# EAGLE design Echo locator (EAGLE 7.6.0)
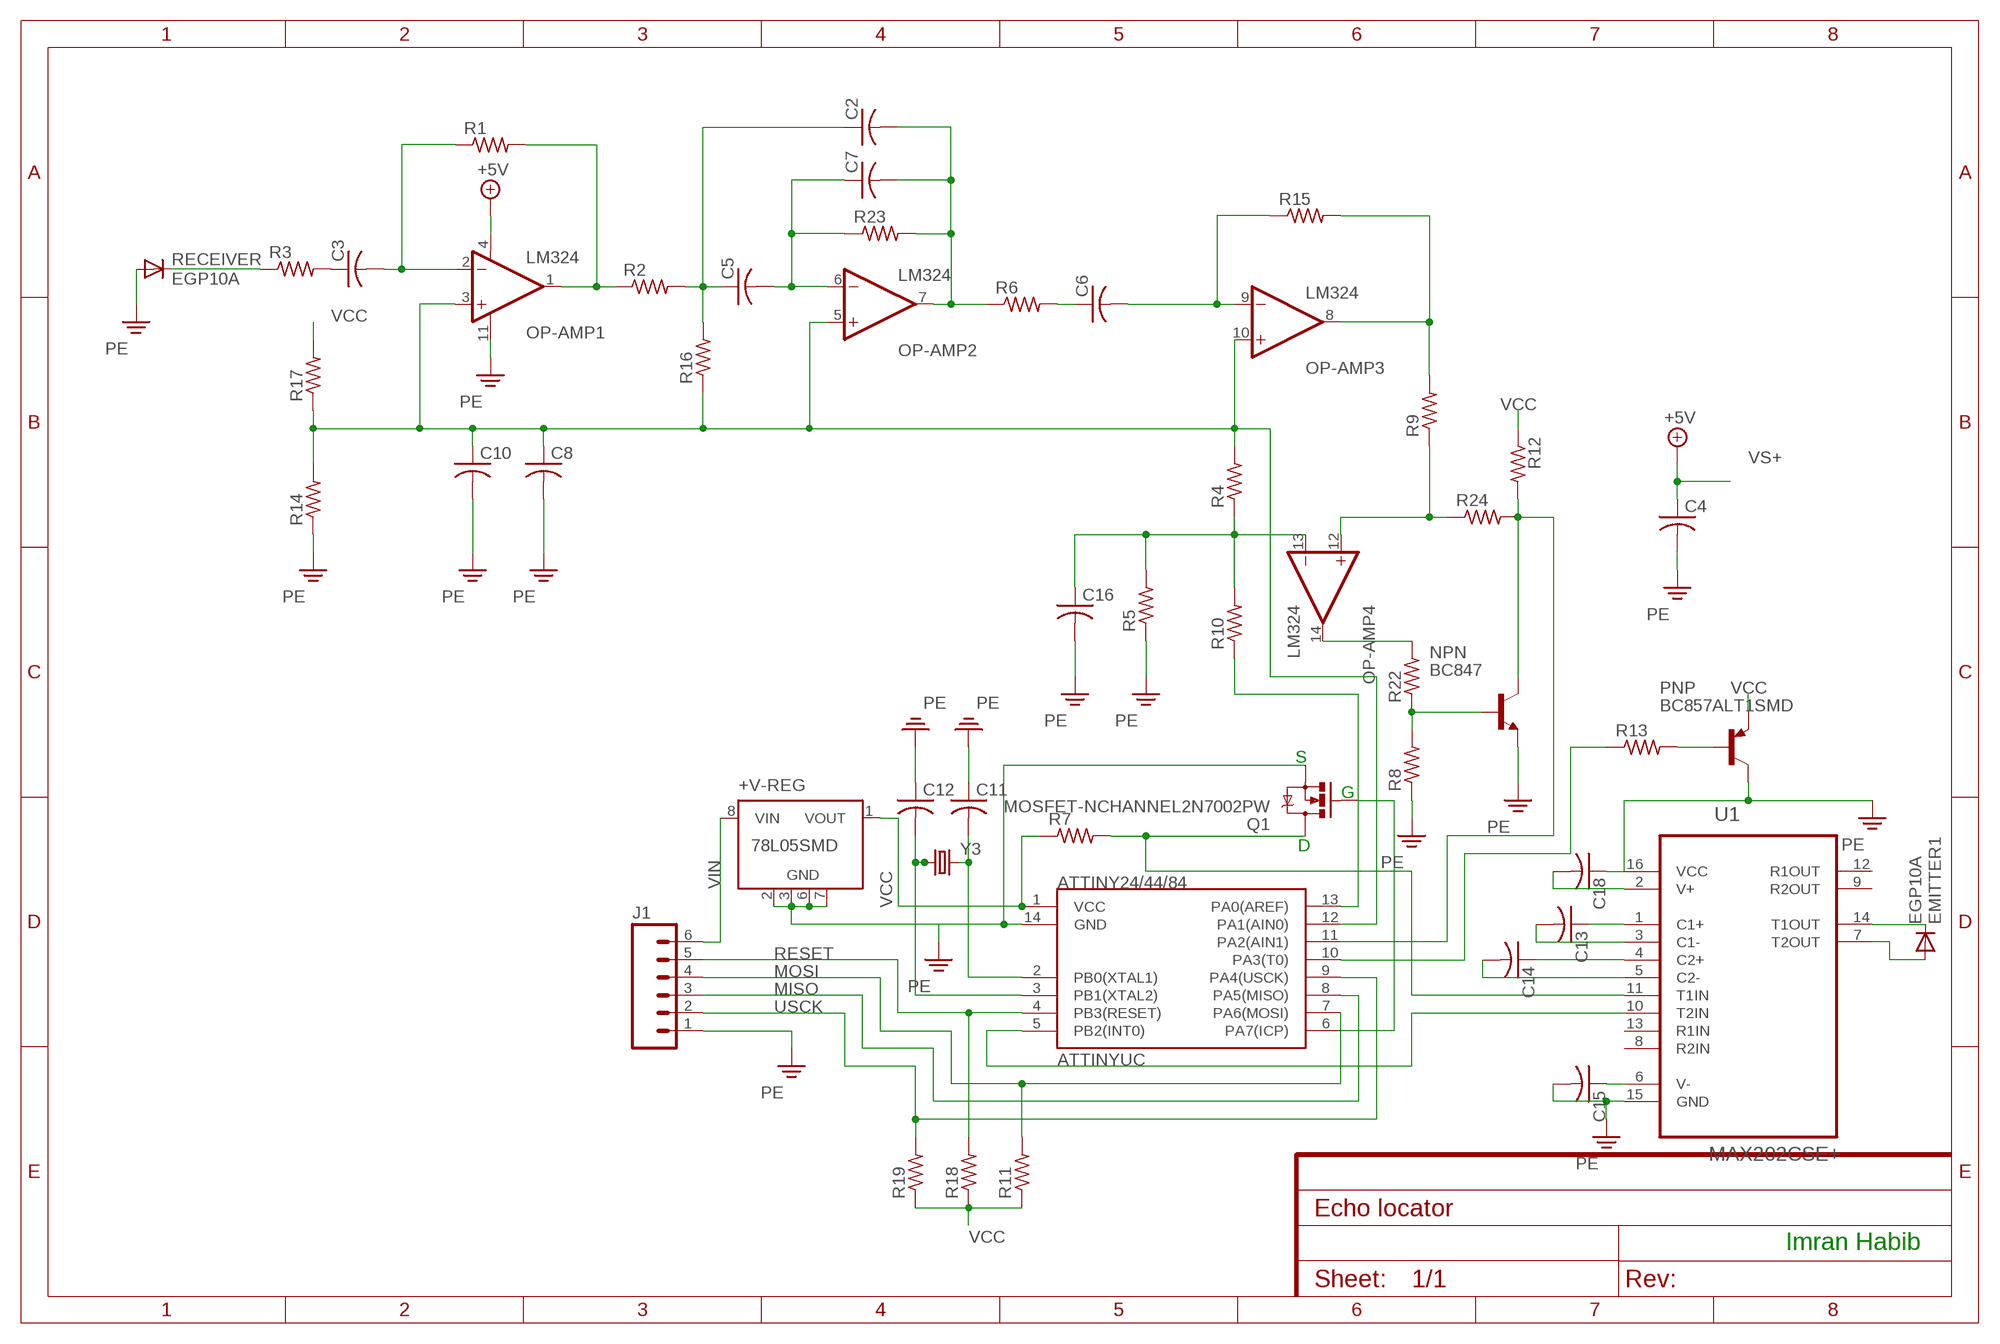
[diagram p0: schematic, sheet 1]

## Parts
+V-REG  78L05SMD  [SO08]
ATTINYUC  ATTINY24  [SOIC-14]
C2  C-USC0805  [C0805]
C3  C-USC0805  [C0805]
C4  C-USC0805  [C0805]
C5  C-USC0805  [C0805]
C6  C-USC0805  [C0805]
C7  C-USC0805  [C0805]
C8  C-USC0805  [C0805]
C10  C-USC0805  [C0805]
C11  C-USC0805  [C0805]
C12  C-USC0805  [C0805]
C13  C-USC0805  [C0805]
C14  C-USC0805  [C0805]
C15  C-USC0805  [C0805]
C16  C-USC0805  [C0805]
C18  C-USC0805  [C0805]
EMITTER1  EGP10A  [DO41-10]
J1  M06LONGPADS  [1X06_LONGPADS]
NPN  BC847  [SOT23]
OP-AMP  LM324  [SOIC-14]
PNP  BC857ALT1SMD  [SOT23-BEC]
Q1  MOSFET-NCHANNEL2N7002PW  [SOT323]
R1  R-US_M2012  [M2012]
R2  R-US_M2012  [M2012]
R3  R-US_M2012  [M2012]
R4  R-US_M2012  [M2012]
R5  R-US_M2012  [M2012]
R6  R-US_M2012  [M2012]
R7  R-US_M0805  [M0805]
R8  R-US_M2012  [M2012]
R9  R-US_M2012  [M2012]
R10  R-US_M2012  [M2012]
R11  R-US_M2012  [M2012]
R12  R-US_M2012  [M2012]
R13  R-US_M2012  [M2012]
R14  R-US_M2012  [M2012]
R15  R-US_M2012  [M2012]
R16  R-US_M2012  [M2012]
R17  R-US_M2012  [M2012]
R18  R-US_M2012  [M2012]
R19  R-US_M2012  [M2012]
R22  R-US_M2012  [M2012]
R23  R-US_M2012  [M2012]
R24  R-US_M2012  [M2012]
RECEIVER  EGP10A  [DO41-10]
U1  MAX202CSE+  [SOIC127P600X175-16N]
Y3  CRYSTALHC49US  [HC49US]

## Nets
+5V: OP-AMP.4(1:V+)
GND: +V-REG.2(GND) +V-REG.3(GND) +V-REG.6(GND) +V-REG.7(GND) ATTINYUC.14(GND) C4.2 C8.2 C10.2 C11.1 C12.1 C16.2 J1.1 NPN.2(E) OP-AMP.11(1:V-) Q1.2(S) R5.1 R8.1 R14.1 RECEIVER.A ; supply symbol labelled PE
MISO: ATTINYUC.8(PA5(MISO)) J1.3
MOSI: ATTINYUC.7(PA6(MOSI)) J1.4 R11.2
N$1: C3.1 R3.2
N$2: C3.2 OP-AMP.2(1:-IN) R1.1
N$3: ATTINYUC.12(PA1(AIN0)) C8.1 C10.1 OP-AMP.3(1:+IN) OP-AMP.5(2:+IN) OP-AMP.10(3:+IN) R4.2 R14.2 R16.1 R17.1
N$4: OP-AMP.1(1:OUT) R1.2 R2.1
N$5: C2.1 C5.1 R2.2 R16.2
N$6: C5.2 C7.1 OP-AMP.6(2:-IN) R23.1
N$7: C6.1 R6.2
N$8: C2.2 C7.2 OP-AMP.7(2:OUT) R6.1 R23.2
N$9: C6.2 OP-AMP.9(3:-IN) R15.1
N$11: OP-AMP.8(3:OUT) R9.2 R15.2
N$12: OP-AMP.14(4:OUT) R22.2
N$13: OP-AMP.12(4:+IN) R9.1 R24.1
N$14: NPN.1(B) R8.2 R22.1
N$15: ATTINYUC.11(PA2(AIN1)) NPN.3(C) R12.2 R24.2
N$16: C16.1 OP-AMP.13(4:-IN) R4.1 R5.2 R10.2
N$18: PNP.B R13.2
N$21: R3.1 RECEIVER.C
N$24: ATTINYUC.10(PA3(T0)) R13.1
N$25: ATTINYUC.13(PA0(AREF)) R10.1
N$27: ATTINYUC.2(PB0(XTAL1)) C11.2 Y3.2
N$28: ATTINYUC.5(PB2(INT0)) U1.10(T2IN)
N$29: ATTINYUC.6(PA7(ICP)) Q1.1(G)
N$31: ATTINYUC.3(PB1(XTAL2)) C12.2 Y3.1
N$40: Q1.3(D) R7.2 U1.11(T1IN)
N$41: C13.1 U1.1(C1+)
N$42: C13.2 U1.3(C1-)
N$43: C14.1 U1.4(C2+)
N$44: C14.2 U1.5(C2-)
N$46: C18.2 U1.2(V+)
N$47: C15.1 U1.6(V-)
N$49: EMITTER1.C U1.14(T1OUT)
N$50: EMITTER1.A U1.7(T2OUT)
PE: C15.2 C18.1 PNP.C U1.15(GND) U1.16(VCC)
RESET: ATTINYUC.4(PB3(RESET)) J1.5 R18.2
USCK: ATTINYUC.9(PA4(USCK)) J1.2 R19.2
VCC: +V-REG.1(VOUT) ATTINYUC.1(VCC) PNP.E R7.1 R11.1 R12.1 R17.2 R18.1 R19.1
VIN: +V-REG.8(VIN) J1.6
VS+: C4.1
Unconnected: +V-REG.4(NC) +V-REG.5(NC) U1.8(R2IN) U1.9(R2OUT) U1.12(R1OUT) U1.13(R1IN)

## Notes on the sheet
- S
- G
- D
- Imran Habib

## Library data of the parts
+V-REG = linear:78L*SMD: Positive VOLTAGE REGULATOR
ATTINYUC = seanvoisen:ATTINY24: Atmel ATtiny24/44/84 Microcontroller
C2-C8 C10-C16 C18 = rcl:C-US: CAPACITOR, American symbol
EMITTER1 RECEIVER = diode:EGP10A: DIODE ultra fast-recovery rectifier
J1 = SparkFun-Connectors:M06: Header 6 Standard 6-pin 0.1" header. Use with straight break away headers (SKU : PRT-00116), right angle break away headers (PRT-00553), swiss pins (PRT-00743), machine pins (PRT-00117), and female headers (PRT-00115). Molex polarized connector foot print use with SKU : PRT-08094 with associated crimp pins and housings. NOTES ON THE VARIANTS LOCK and LOCK_LONGPADS... This footprint was designed to help hold the alignment of a through-hole component (i.e. 6-pin header) while soldering it into place. You may notice that each hole has been shifted either up or down by 0.005 of an inch from it's more standard position (which is a perfectly straight line). This slight alteration caused the pins (the squares in the middle) to touch the edges of the holes. Because they are alternating, it causes a "brace" to hold the component in place. 0.005 has proven to be the perfect amount of "off-center" position when using our standard breakaway headers. Although looks a little odd when you look at the bare footprint, once you have a header in there, the alteration is very hard to notice. Also,if you push a header all the way into place, it is covered up entirely on the bottom side. This idea of altering the position of holes to aid alignment will be further integrated into the Sparkfun Library for other footprints. It can help hold any component with 3 or more connection pins.
NPN = transistor:BC847: NPN TRANSISTOR
OP-AMP = seanvoisen:LM324: LM324 Quad Op-amp
PNP = transistor-pnp:BC857*: PNP Transistror
Q1 = SparkFun-DiscreteSemi:MOSFET-NCHANNEL: Common NMOSFET Parts MFG P/N Store ID Prod ID FDD8780 TRANS-09984 SI7820DN TRANS-11055 FDS6630A IC-08089 2N7002PW TRANS-11151 FQP30N06L COM-10213 TRANS-10060 BSS123LT1G TRANS-08345 BSS138 TRANS-00830 BS170 2N7000; PROD_ID: TRANS-11151
R1-R19 R22-R24 = rcl:R-US_: RESISTOR, American symbol
U1 = Maxim_By_element14_Batch_1:MAX202CSE+: Transceivers; MPN: MAX202CSE+; OC_FARNELL: 9725989; OC_NEWARK: 87H1303; PACKAGE: SOIC-16; SUPPLIER: Maxim
Y3 = SparkFun-FreqCtrl:CRYSTAL: Various standard crystals. Proven footprints.

## Board
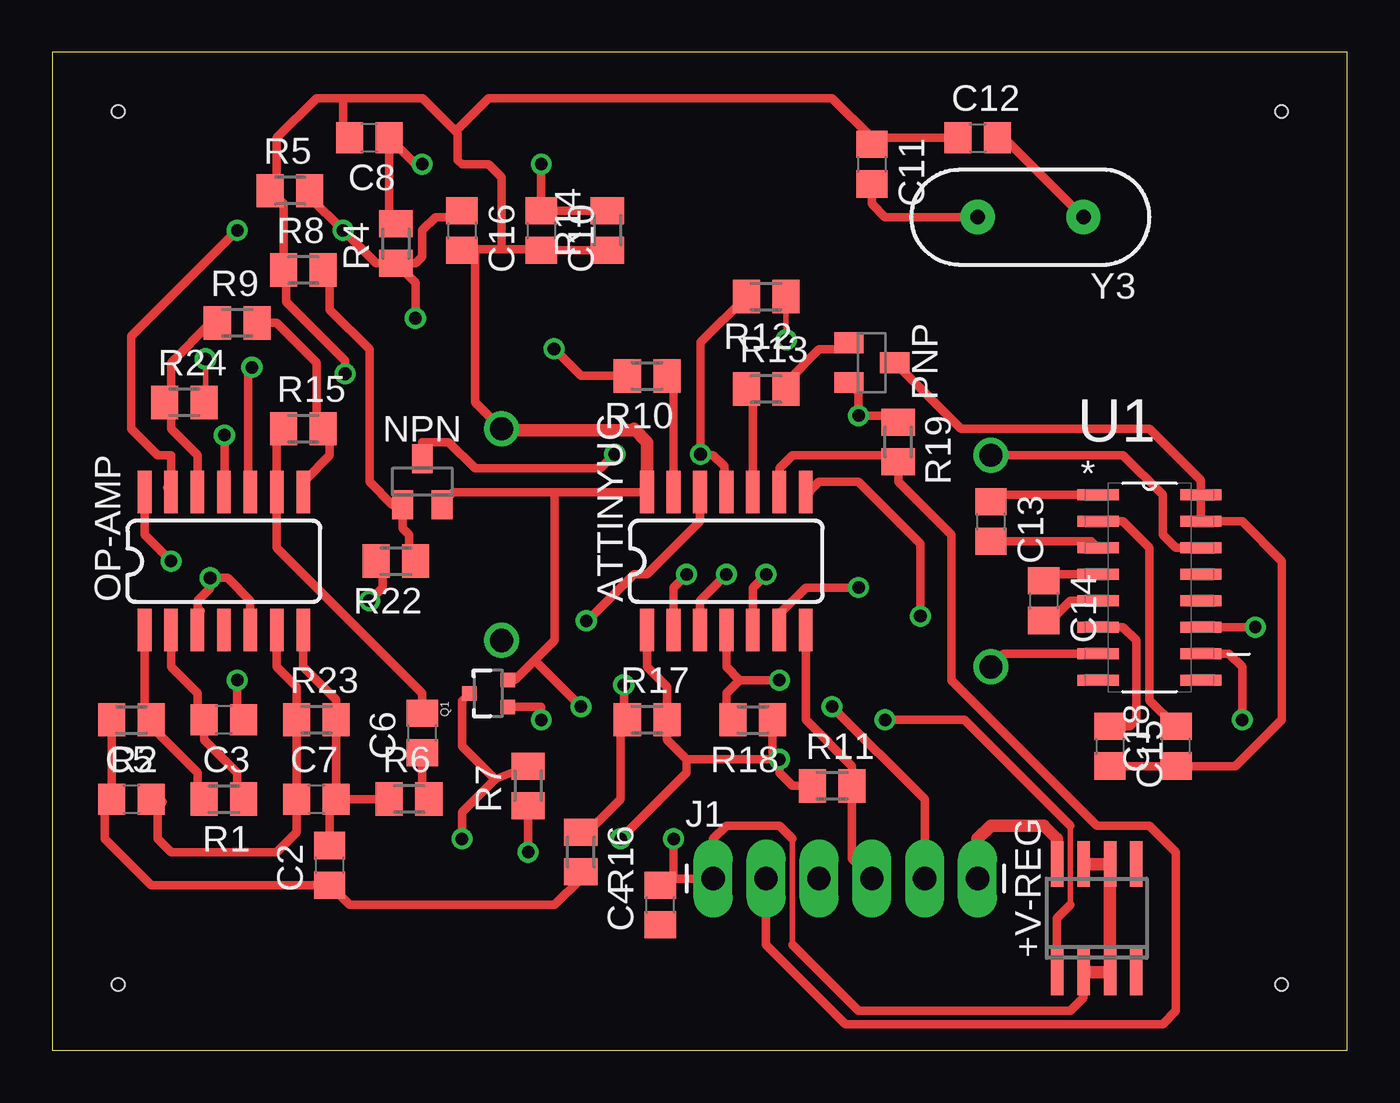
[diagram p1: board, top side]
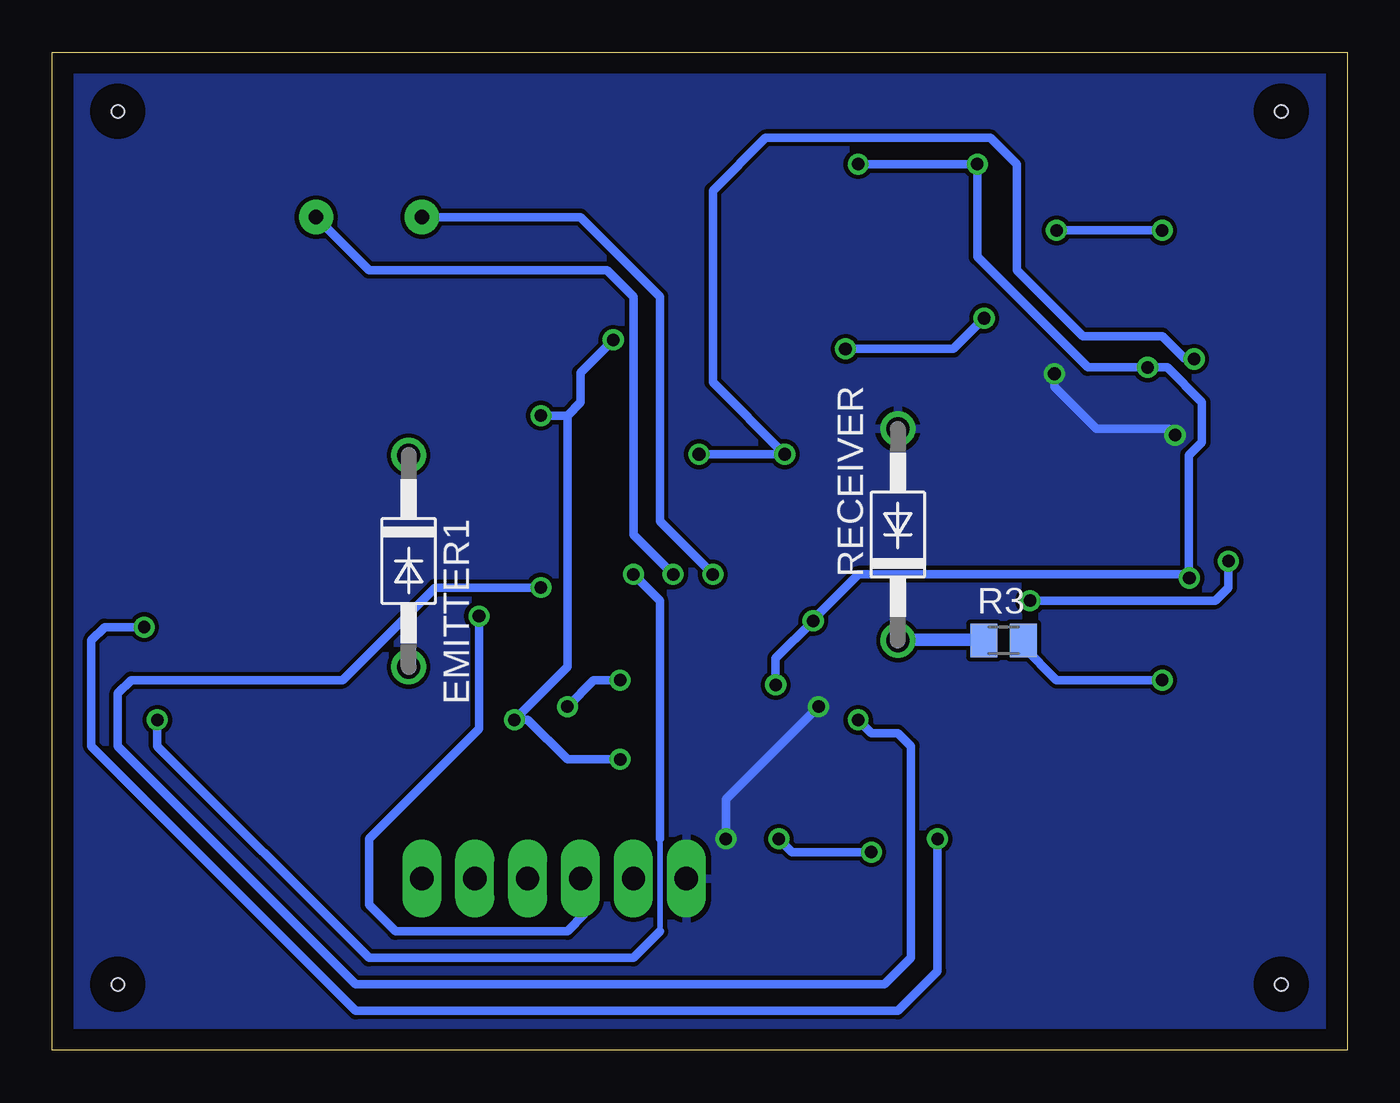
[diagram p2: board, bottom side, seen from below]

Size 62.21 x 47.93 mm. Coordinates in mm from the lower left corner, seen from the top.
Outline: 0,0 62.21,0 62.21,47.93 0,47.93 0,0
Copper layers (1*16): Top 0.035mm / dielectric 1.5mm / Bottom 0.035mm
Design rules "default": minimum track width 10mil, minimum drill 24mil, track to track 8mil, track to pad 8mil, pad to pad 8mil, via to via 8mil, smd to smd 8mil, copper to edge 40mil, drill to drill 8mil, minimum pad ring 10mil, minimum via ring 8mil, stop-mask expansion 4mil, vias tented up to drill 0mil, thermal gap 10mil
Holes 0.6 mm at 59.05,3.17 3.17,3.17 3.17,45.09 59.05,45.09

### Footprints (pad centres in the part's own frame; a part is rotated, then mirrored left to right if it is on the bottom)
SO08 = smd 0.6 x 2.2: 1 -1.905,-2.6; 2 -0.635,-2.6; 3 0.635,-2.6; 4 1.905,-2.6; 5 1.905,2.6; 6 0.635,2.6; 7 -0.635,2.6; 8 -1.905,2.6
SOIC-14 = smd 0.66 x 2.032: 1 -4.445,-3.315; 2 -3.175,-3.315; 3 -1.905,-3.315; 4 -0.635,-3.315; 5 0.635,-3.315; 6 1.905,-3.315; 7 3.175,-3.315; 8 3.175,3.315; 9 1.905,3.315; 10 0.635,3.315; 11 -0.635,3.315; 12 -1.905,3.315; 13 -3.175,3.315; 14 -4.445,3.315
C0805 = smd 1.3 x 1.5: 1 -0.95,0; 2 0.95,0
DO41-10 = drill 1.118: A 5.08,0; C -5.08,0
1X06_LONGPADS = drill 1.118 pad 1.88 long: 1 0,0; 2 2.54,0; 3 5.08,0; 4 7.62,0; 5 10.16,0; 6 12.7,0
SOT23 = smd 1 x 1.4: 1 -0.95,-1.1; 2 0.95,-1.1; 3 0,1.1
SOT23-BEC = smd 1 x 1.4: B -0.95,-1.1; C 0,1.1; E 0.95,-1.1
SOT323 = smd 0.7 x 0.7: 1 -0.65,-0.925; 2 0.65,-0.925; 3 0,0.925
M2012 = smd 1.3 x 1.6: 1 -0.95,0; 2 0.95,0
M0805 = smd 1.3 x 1.6: 1 -0.95,0; 2 0.95,0
SOIC127P600X175-16N = smd 1.981 x 0.533: 1 -2.464,4.445; 2 -2.464,3.175; 3 -2.464,1.905; 4 -2.464,0.635; 5 -2.464,-0.635; 6 -2.464,-1.905; 7 -2.464,-3.175; 8 -2.464,-4.445; 9 2.464,-4.445; 10 2.464,-3.175; 11 2.464,-1.905; 12 2.464,-0.635; 13 2.464,0.635; 14 2.464,1.905; 15 2.464,3.175; 16 2.464,4.445
HC49US = drill 0.7 pad 1.651: 1 -2.54,0; 2 2.54,0

### Placement (x,y rotation side)
+V-REG  50.16,6.35 0 top
ATTINYUC  33.02,23.5 0 top
C2  13.34,8.89 90 top
C3  8.26,15.88 180 top
C4  29.21,6.99 90 top
C5  3.81,12.06 0 top
C6  17.78,15.24 90 top
C7  12.7,12.06 0 top
C8  15.24,43.81 180 top
C10  23.5,39.37 270 top
C11  39.37,42.55 270 top
C12  44.45,43.81 0 top
C13  45.09,25.4 270 top
C14  47.62,21.59 270 top
C15  50.8,14.61 270 top
C16  19.68,39.37 270 top
C18  53.98,14.61 90 top
EMITTER1  45.09,23.5 270 bottom
J1  31.75,8.26 0 top
NPN  17.78,27.3 0 top
OP-AMP  8.89,23.5 0 top
PNP  39.37,33.02 270 top
Q1  20.95,17.14 90 top
R1  8.26,12.06 180 top
R2  3.81,15.88 180 top
R3  16.51,19.68 0 bottom
R4  16.51,38.73 90 top
R5  11.43,41.27 0 top
R6  17.14,12.06 0 top
R7  22.86,12.7 90 top
R8  12.06,37.47 0 top
R9  8.89,34.92 0 top
R10  28.57,32.38 180 top
R11  37.47,12.7 0 top
R12  34.29,36.2 180 top
R13  34.29,31.75 0 top
R14  26.67,39.37 90 top
R15  12.06,29.84 0 top
R16  25.4,9.53 270 top
R17  28.57,15.88 0 top
R18  33.66,15.88 180 top
R19  40.64,29.21 270 top
R22  16.51,23.5 180 top
R23  12.7,15.88 0 top
R24  6.35,31.11 0 top
RECEIVER  21.59,24.77 90 bottom
U1  52.7,22.23 0 top
Y3  46.99,40.01 180 top

### Tracks (layer width: path | path; a pad name or v marks a point on that pad's centre or on a via)
GND  (via drill 0.6, 0.61)
  Top 0.254: 14.22,43.26 14.22,43.71 C8.2 | 20.32,38.46 19.71,38.46 C16.2 | 26.57,38.46 R14.1 | 18.8,26.34 NPN.2 18.57,26.34 | 28.4,26.8 ATTINYUC.14 28.4,27.03 | 11.25,37.31 R8.1 | 8.28,27.03 OP-AMP.11 | 21.77,29.77 RECEIVER.A | 35.56,5.08 35.56,10.16
  Top 0.406: C12.1 39.69,43.81 C11.1 39.37,43.81 37.47,45.72 20.95,45.72 19.37,44.13 | C8.2 13.97,44.13 13.97,45.72 | 24.13,26.81 24.13,19.68 23.18,18.73 | 18.8,26.34 19.27,26.81 24.13,26.81 | 24.13,26.81 ATTINYUC.14 | 27.94,29.84 RECEIVER.A 20.32,31.11 20.32,38.46 21.59,38.46 | 21.59,38.46 21.59,41.91 20.95,42.55 19.68,42.55 19.48,42.75 19.48,44.02 19.37,44.13 | 21.59,38.46 23.46,38.46 C10.2 R14.1 | 8.28,27.03 v8.28,29.54 | 13.97,45.72 17.79,45.72 19.37,44.13 | 13.97,45.72 12.7,45.72 10.79,43.81 10.79,41.59 R5.1 11.12,40.64 R8.1 11.25,37.33 11.25,35.94 14.07,33.12 v14.07,32.49 | 23.18,18.73 22.24,17.8 Q1.2 | C4.2 29.53,8.26 29.84,8.26 | 29.84,8.26 J1.1 31.75,10.16 32.38,10.79 34.92,10.79 35.56,10.16 | 35.56,5.08 38.73,1.91 48.9,1.91 49.53,2.54 +V-REG.2 | 29.84,8.26 v29.84,10.16 | v25.4,16.51 23.18,18.73
  Top 0.61: 21.77,29.77 27.86,29.77 27.94,29.84 28.57,29.21 ATTINYUC.14 | +V-REG.7 +V-REG.6 +V-REG.3 +V-REG.2
  Bottom 0.254: 21.77,29.77 RECEIVER.A
  Bottom 0.406: v8.28,29.54 8.59,29.84 12.06,29.84 14.07,31.85 v14.07,32.49 | v29.84,10.16 29.84,12.06 v25.4,16.51
  pour Bottom: 0,0 0,47.62 62.23,47.62 62.23,0
MISO  (via drill 0.61)
  Top 0.254: 36.4,26.8 ATTINYUC.8
  Top 0.406: 36.4,26.8 36.4,26.87 36.83,27.3 38.73,27.3 41.71,24.33 v41.71,20.85
  Bottom 0.406: J1.3 36.63,8.26 36.63,6.55 37.47,5.71 45.72,5.71 46.99,6.99 46.99,10.16 41.71,15.44 v41.71,20.85
MOSI
  Top 0.254: 36.4,20.17 ATTINYUC.7
  Top 0.406: J1.4 38.41,9.21 R11.2 38.41,13.65 36.2,15.88 ATTINYUC.7
N$1  (via drill 0.6)
  Top 0.406: C3.1 8.89,16.19 v8.89,17.78
  Bottom 0.406: v8.89,17.78 13.97,17.78 15.56,19.37 R3.2
N$2
  Top 0.406: R1.1 8.89,12.38 8.89,13.34 7.3,14.92 C3.2 6.99,16.2 6.99,17.14 5.71,18.41 OP-AMP.2
N$3  (via drill 0.6, 0.61)
  Top 0.254: 7.14,21.08 7.14,20.4 OP-AMP.3 | 9.42,20.85 9.42,20.4 OP-AMP.5 | 26.57,40.51 R14.2 | 16.28,43.71 C8.1 | 9.42,27.03 OP-AMP.10
  Top 0.406: v27.46,17.55 27.46,16.04 R17.1 27.3,15.55 27.3,12.06 25.71,10.47 R16.1 | R14.2 C10.1 v23.5,42.55 | 7.14,21.08 6.99,21.23 6.99,21.59 7.59,22.2 v7.59,22.68 8.43,22.68 9.53,21.59 9.53,20.95 9.42,20.85 | 9.42,27.03 9.42,32.61 v9.6,32.79 | ATTINYUC.12 31.11,25.4 28.57,22.86 27.94,22.86 25.7,20.62 v25.65,20.62 | R4.2 16.19,40.01 C8.1 | 16.28,43.71 17.45,42.55 v17.78,42.55
  Bottom 0.406: v27.46,17.55 27.46,18.82 v25.65,20.62 25.65,20.7 23.5,22.86 7.77,22.86 v7.59,22.68 7.62,22.71 7.62,28.57 6.99,29.21 6.99,31.11 8.66,32.79 v9.6,32.79 12.47,32.79 17.78,38.1 v17.78,42.55 v23.5,42.55
N$4
  Top 0.406: R1.2 6.99,12.38 6.99,13.34 4.76,15.56 R2.1 4.76,16.2 4.45,16.51 OP-AMP.1
N$5
  Top 0.254: 2.79,11.94 C5.1
  Top 0.406: R2.2 C5.1 2.54,11.74 2.54,10.16 4.76,7.93 11.75,7.93 C2.1 14.29,6.99 24.13,6.99 25.4,8.26 R16.2
N$6
  Top 0.254: 5.31,11.94 4.85,11.94 C5.2 | 11.71,11.94 C7.1
  Top 0.406: OP-AMP.6 10.79,18.41 11.75,17.46 R23.1 C7.1 11.75,10.48 10.79,9.53 5.71,9.53 5.08,10.16 5.08,11.71 5.31,11.94
N$7
  Top 0.406: R6.2 17.78,12.38 C6.1
N$8
  Top 0.406: OP-AMP.7 12.06,18.41 13.65,16.83 R23.2 C7.2 | C7.2 R6.1 | C7.2 13.34,11.75 C2.2
N$9
  Top 0.406: C6.2 17.78,17.14 10.79,24.13 OP-AMP.9 10.79,29.52 R15.1
N$11
  Top 0.254: 12.17,27.03 OP-AMP.8
  Top 0.406: 12.17,27.03 12.17,27.41 13.34,28.57 13.34,29.52 R15.2 12.7,30.16 12.7,33.02 10.79,34.92 R9.2
N$12  (via drill 0.6)
  Top 0.406: OP-AMP.14 4.45,24.77 v5.71,23.5 | R22.2 15.88,23.18 15.88,22.23 v15.24,21.59
  Bottom 0.406: v5.71,23.5 5.71,22.23 6.35,21.59 v15.24,21.59
N$13
  Top 0.406: R9.1 7.62,34.92 5.71,33.02 5.71,31.43 R24.1 5.71,30.8 5.71,29.84 6.99,28.57 OP-AMP.12
N$14
  Top 0.406: R8.2 13.34,37.15 13.34,35.56 15.24,33.66 15.24,27.3 16.34,26.2 NPN.1 16.83,25.08 17.14,24.77 17.14,23.81 R22.1
N$15  (via drill 0.61)
  Top 0.254: 32.28,27.48 32.28,27.03 ATTINYUC.11 | 17.88,28.63 NPN.3 | v7.37,33.2 7.37,31.14 R24.2 | 33.2,36.17 R12.2
  Top 0.406: 32.28,27.48 32.28,28.04 31.75,28.57 31.19,28.57 v31.14,28.63 31.14,33.99 R12.2 | 18,28.63 NPN.3 17.78,29.21 19.05,29.21 20.32,27.94 26.34,27.94 v27.03,28.63
  Bottom 0.406: v31.14,28.63 v27.03,28.63 30.48,32.08 30.48,41.27 27.94,43.81 17.14,43.81 15.88,42.55 15.88,37.47 12.7,34.29 8.89,34.29 7.8,33.2 v7.37,33.2
N$16  (via drill 0.6, 0.61)
  Top 0.254: 5.54,27.03 OP-AMP.13
  Top 0.406: R10.2 25.4,32.38 v24.11,33.68 | C16.1 19.37,40.01 18.41,40.01 17.78,39.37 17.78,38.1 17.46,37.78 R4.1 | v17.45,35.15 17.45,36.84 R4.1 | 5.54,27.03 5.71,27.2 5.71,28.57 5.08,28.57 3.81,29.84 3.81,34.29 v8.89,39.37 | R4.1 15.55,37.78 v13.97,39.37 12.38,40.96 R5.2
  Bottom 0.406: v24.11,33.68 18.92,33.68 v17.45,35.15 | v8.89,39.37 v13.97,39.37
N$18
  Top 0.254: 35.7,31.29 R13.2
  Top 0.406: PNP.B 37.95,33.66 36.83,33.66 35.24,32.06 R13.2
N$21
  Bottom 0.254: 17.65,19.71 R3.1
  Bottom 0.61: 17.65,19.71 21.57,19.71 RECEIVER.C
N$24
  Top 0.254: 33.66,31.43 R13.1
  Top 0.406: ATTINYUC.10 33.66,31.75 R13.1
N$25
  Top 0.406: ATTINYUC.13 29.84,32.06 R10.1
N$27  (via drill 0.6)
  Top 0.406: v30.48,22.86 29.84,22.23 ATTINYUC.2 | C11.2 39.37,40.64 40.01,40.01 Y3.2
  Bottom 0.406: v30.48,22.86 33.02,25.4 33.02,36.2 36.83,40.01 Y3.2
N$28  (via drill 0.6)
  Top 0.406: ATTINYUC.5 33.66,22.23 v34.29,22.86 | v57.15,15.88 57.15,18.41 56.52,19.05 U1.10
  Bottom 0.254: 33.02,10.16 33.02,5.71
  Bottom 0.406: v34.29,22.86 33.02,21.59 33.02,10.16 | 33.02,5.71 34.29,4.45 46.99,4.45 57.15,14.61 v57.15,15.88
N$29  (via drill 0.6)
  Top 0.406: ATTINYUC.6 34.92,20.95 36.2,22.23 v38.73,22.23 | v23.5,15.88 23.5,16.51 21.89,16.51 Q1.1
  Bottom 0.406: v23.5,15.88 22.86,15.24 21.59,15.24 20.95,14.61 20.95,4.45 22.23,3.17 47.62,3.17 59.05,14.61 59.05,17.14 58.42,17.78 48.26,17.78 43.81,22.23 v38.73,22.23
N$31  (via drill 0.6)
  Top 0.406: C12.2 45.72,43.81 Y3.1 | v32.38,22.86 31.11,21.59 ATTINYUC.3
  Bottom 0.406: v32.38,22.86 34.29,24.77 34.29,36.2 35.56,37.47 46.99,37.47 Y3.1
N$40  (via drill 0.6)
  Top 0.406: R7.2 21.27,13.02 | 21.27,13.02 19.68,14.61 19.68,16.8 Q1.3 | v19.68,10.16 19.68,11.43 21.27,13.02 | U1.11 v57.78,20.32
  Bottom 0.406: v19.68,10.16 19.68,3.81 21.59,1.91 47.62,1.91 60.33,14.61 60.33,19.68 59.69,20.32 v57.78,20.32
N$41
  Top 0.406: C13.1 45.41,26.67 U1.1
N$42
  Top 0.406: U1.3 49.92,24.45 C13.2
N$43
  Top 0.406: C14.1 47.94,22.54 48.26,22.86 U1.4
N$44
  Top 0.406: C14.2 47.95,20.64 48.9,21.59 U1.5
N$46
  Top 0.406: U1.2 51.44,25.4 52.7,24.13 52.7,16.82 C18.2
N$47
  Top 0.406: C15.1 51.75,15.55 52.07,15.88 52.07,19.68 51.44,20.32 U1.6
N$49
  Top 0.406: EMITTER1.C 51.44,28.57 53.34,26.67 53.34,24.77 53.98,24.13 U1.14
N$50
  Top 0.406: EMITTER1.A 45.72,19.05 U1.7
PE
  Top 0.406: C15.2 C18.1 56.84,13.65 59.05,15.88 59.05,23.5 57.15,25.4 U1.15 U1.16 55.17,27.38 52.7,29.84 43.65,29.84 PNP.C
RESET  (via drill 0.6)
  Top 0.406: J1.5 41.91,12.06 v37.47,16.51 | v34.92,17.78 33.02,17.78 | 33.02,17.78 32.38,17.14 32.38,16.2 R18.2 | ATTINYUC.4 32.38,18.41 33.02,17.78
  Bottom 0.406: v37.47,16.51 36.2,17.78 v34.92,17.78
USCK
  Top 0.406: ATTINYUC.9 34.92,27.94 35.56,28.57 40.33,28.57 R19.2 40.64,27.3 43.18,24.77 43.18,17.78 50.16,10.79 52.7,10.79 53.98,9.53 53.98,1.91 53.34,1.27 38.1,1.27 34.29,5.08 J1.2
VCC  (via drill 0.6, 0.61)
  Top 0.254: v35.26,34.11 35.26,36.17 R12.1 | 48.9,6.99 48.9,10.79
  Top 0.406: v34.92,13.97 34.6,14.29 R18.1 | ATTINYUC.1 28.57,18.41 29.52,17.46 R17.2 29.52,14.93 30.48,13.97 | v22.86,9.53 R7.1 | +V-REG.1 48.26,6.35 48.9,6.99 | 48.9,10.79 43.81,15.88 v40.01,15.88 | R11.1 35.56,12.7 34.92,13.34 v34.92,13.97 | PNP.E 38.73,31.61 v38.73,30.48 40.32,30.48 R19.1 | v34.92,13.97 30.48,13.97 | v27.3,10.16 30.48,13.34 30.48,13.97
  Bottom 0.406: v35.26,34.11 36.83,32.54 36.83,31.11 37.47,30.48 | v22.86,9.53 26.67,9.53 v27.3,10.16 | v34.92,13.97 37.47,13.97 39.37,15.88 v40.01,15.88 37.47,18.41 37.47,30.48 | 37.47,30.48 v38.73,30.48
VIN
  Top 0.61: +V-REG.8 48.26,10.16 47.62,10.79 45.09,10.79 44.45,10.16 J1.6